# Altium project TouchBoard.PrjPcb
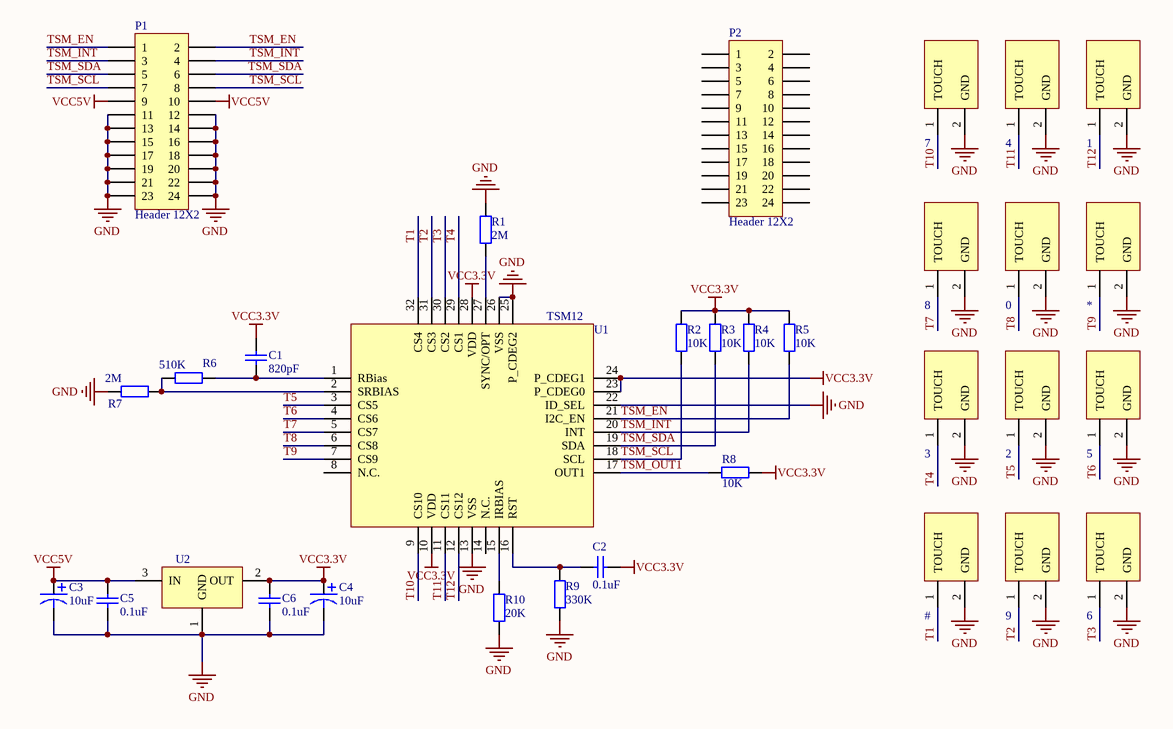
[diagram p0: touch.SchDoc]
1 sheet, 32 parts. Net scope: global (net labels, ports and power ports of the same name join across sheets).
Board file: TouchBoard.PcbDoc

## Sheet touch.SchDoc
size A4

### Parts
0  touchPad  [TOUCH_PAD]  (value not drawn)
1  touchPad  [TOUCH_PAD]  (value not drawn)
2  touchPad  [TOUCH_PAD]  (value not drawn)
3  touchPad  [TOUCH_PAD]  (value not drawn)
4  touchPad  [TOUCH_PAD]  (value not drawn)
5  touchPad  [TOUCH_PAD]  (value not drawn)
6  touchPad  [TOUCH_PAD]  (value not drawn)
7  touchPad  [TOUCH_PAD]  (value not drawn)
8  touchPad  [TOUCH_PAD]  (value not drawn)
9  touchPad  [TOUCH_PAD]  (value not drawn)
#  touchPad  [TOUCH_PAD]  (value not drawn)
*  touchPad  [TOUCH_PAD]  (value not drawn)
C1  820pF  [0603_C]
C2  0.1uF  [0603_C]
C3  10uF  [1206_C]
C4  10uF  [1206_C]
C5  0.1uF  [0603_C]
C6  0.1uF  [0603_C]
P1  Header 12X2  [12x2_2.0mm]
P2  Header 12X2  [12x2_2.0mm]
R1  2M  [0603_R]
R2  10K  [0603_R]
R3  10K  [0603_R]
R4  10K  [0603_R]
R5  10K  [0603_R]
R6  510K  [0603_R]
R7  2M  [0603_R]
R8  10K  [0603_R]
R9  330K  [0603_R]
R10  20K  [0603_R]
U1  TSM12  [MLF-32]
U2  LM1117  [SOT-223]  (value not drawn)

### Nets
GND: 0.2(GND) 1.2(GND) 2.2(GND) 3.2(GND) 4.2(GND) 5.2(GND) 6.2(GND) 7.2(GND) 8.2(GND) 9.2(GND) #.2(GND) *.2(GND) C3.2 C4.2 C5.2 C6.2 P1.11 P1.12 P1.13 P1.14 P1.15 P1.16 P1.17 P1.18 P1.19 P1.20 P1.21 P1.22 P1.23 P1.24 R1.2 R7.1 R9.1 R10.1 U1.13(VSS) U1.22(ID_SEL) U1.25(P_CDEG2) U1.26(VSS) U2.1(GND)
VCC3.3V: C1.2 C2.1 C4.1 C6.1 R2.1 R3.1 R4.1 R5.1 R8.1 U1.10(VDD) U1.23(P_CDEG0) U1.24(P_CDEG1) U1.28(VDD) U2.2(OUT)
VCC5V: C3.1 C5.1 P1.9 P1.10 U2.3(IN)
T1: #.1(TOUCH) U1.32(CS4)
T2: 9.1(TOUCH) U1.31(CS3)
T3: 6.1(TOUCH) U1.30(CS2)
T4: 3.1(TOUCH) U1.29(CS1)
T5: 2.1(TOUCH) U1.3(CS5)
T6: 5.1(TOUCH) U1.4(CS6)
T7: 8.1(TOUCH) U1.5(CS7)
T8: 0.1(TOUCH) U1.6(CS8)
T9: *.1(TOUCH) U1.7(CS9)
T10: 7.1(TOUCH) U1.9(CS10)
T11: 4.1(TOUCH) U1.11(CS11)
T12: 1.1(TOUCH) U1.12(CS12)
TSM_EN: P1.1 P1.2 R5.2 U1.21(I2C_EN)
TSM_INT: P1.3 P1.4 R4.2 U1.20(INT)
TSM_OUT1: R8.2 U1.17(OUT1)
TSM_SCL: P1.7 P1.8 R2.2 U1.18(SCL)
TSM_SDA: P1.5 P1.6 R3.2 U1.19(SDA)
NetC1_1: C1.1 R6.2 U1.1(RBias)
NetC2_2: C2.2 R9.2 U1.16(RST)
NetR1_1: R1.1 U1.27(SYNC/OPT)
NetR6_1: R6.1 R7.2 U1.2(SRBIAS)
NetR10_2: R10.2 U1.15(IRBIAS)

Not connected (* = marked no-connect by the designer): P2 1 2 3 4 5 6 7 8 9 10 11 12 13 14 15 16 17 18 19 20 21 22 23 24; U1 8(N.C.) 14(N.C.)

### Library data of the parts
C1 C2 C5 C6 = Cap: 贴片电容，0603
C3 C4 = CAPACITOR: 贴片电容，1206
P1 P2 = Header 12X2: Header, 12-Pin, Dual row, 2.0mm
R1-R10 = Res2: 贴片电阻，0603
U1 = ADSTSM12: 触摸芯片，TSM12M，MLF-32封装